# Altium project GeecPC.PrjPcb
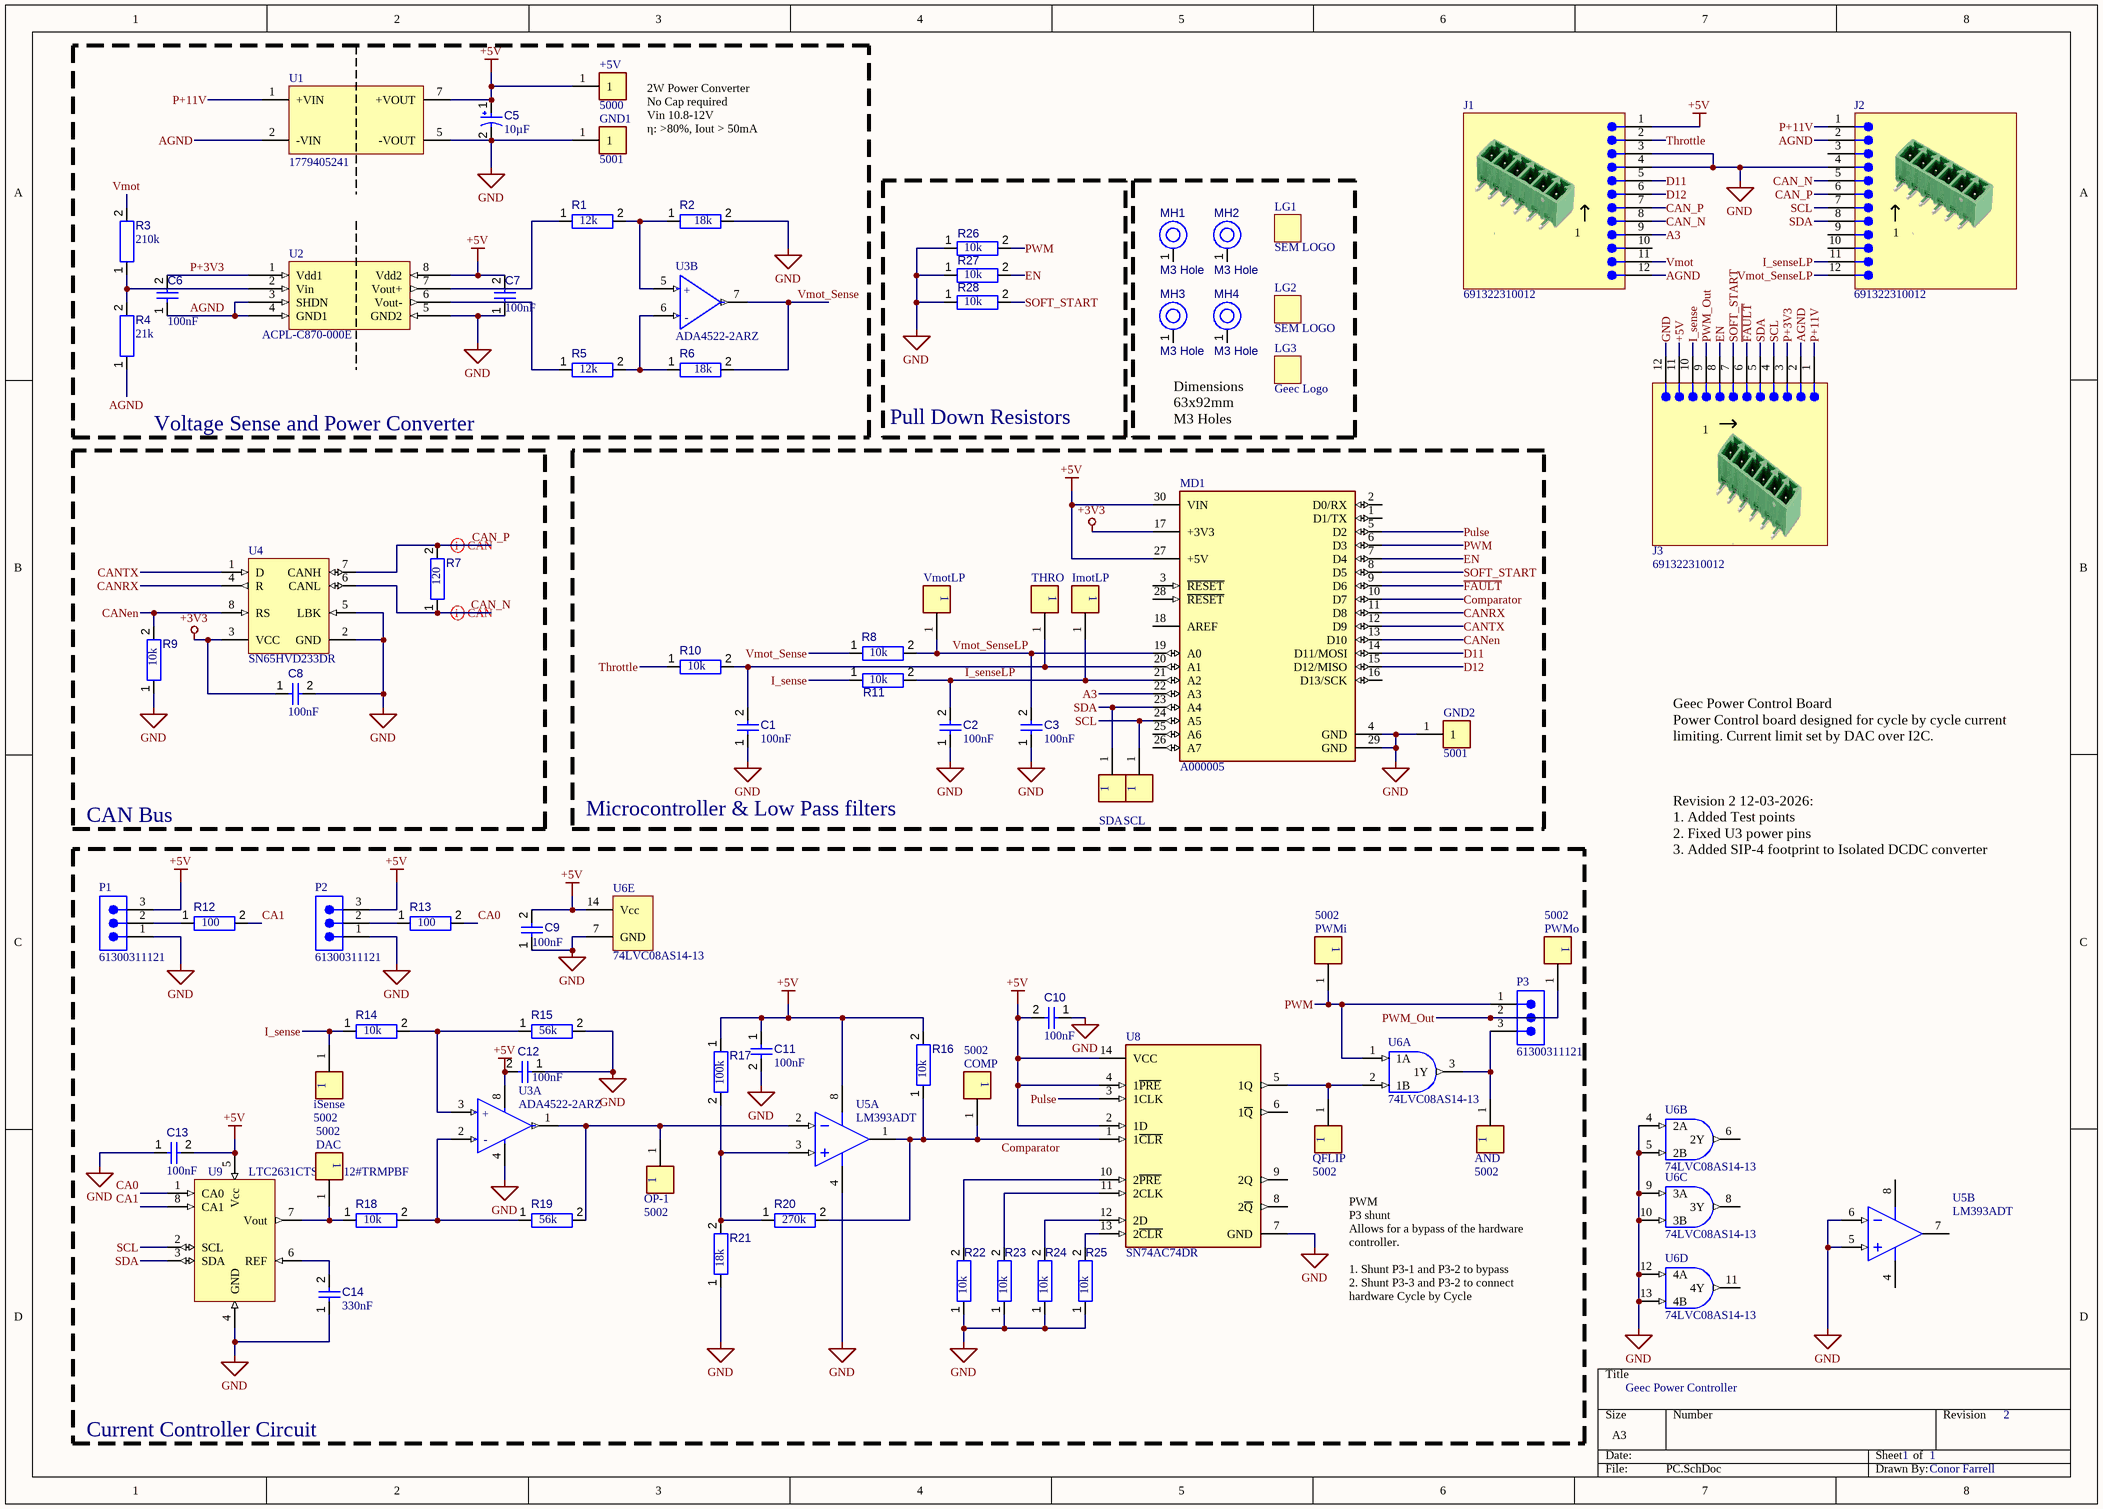
[diagram p0: PC.SchDoc]
1 sheet, 79 parts. Net scope: global (net labels, ports and power ports of the same name join across sheets).
Board file: PowerController.PcbDoc

## Sheet PC.SchDoc: Geec Power Controller
size A3; Author: Conor Farrell; Revision: 2; SheetNumber: 1; SheetTotal: 1

### Parts
+5V  5000  [FP-5000-MFG]
AND  5002  [FP-5002-MFG]
C1  value 100nF  [Cap-THT-Ceramic(7.2X2.5)]  (hidden comment: 100n-THT)
C2  value 100nF  [Cap-THT-Ceramic(7.2X2.5)]  (hidden comment: 100n-THT)
C3  value 100nF  [Cap-THT-Ceramic(7.2X2.5)]  (hidden comment: 100n-THT)
C5  value 10µF  [CAPPR55-200-1100X500X1200]  (hidden comment: ECA1HM100)
C6  value 100nF  [Cap-THT-Ceramic(7.2X2.5)]  (hidden comment: 100n-THT)
C7  value 100nF  [Cap-THT-Ceramic(7.2X2.5)]  (hidden comment: 100n-THT)
C8  value 100nF  [Cap-THT-Ceramic(7.2X2.5)]  (hidden comment: 100n-THT)
C9  value 100nF  [Cap-THT-Ceramic(7.2X2.5)]  (hidden comment: 100n-THT)
C10  value 100nF  [Cap-THT-Ceramic(7.2X2.5)]  (hidden comment: 100n-THT)
C11  value 100nF  [Cap-THT-Ceramic(7.2X2.5)]  (hidden comment: 100n-THT)
C12  value 100nF  [Cap-THT-Ceramic(7.2X2.5)]  (hidden comment: 100n-THT)
C13  value 100nF  [Cap-THT-Ceramic(7.2X2.5)]  (hidden comment: 100n-THT)
C14  value 330nF  [Cap-THT-Ceramic(7.2X2.5)]  (hidden comment: 330nF-THT-Film)
COMP  5002  [FP-5002-MFG]
DAC  5002  [FP-5002-MFG]
GND1  5001  [FP-5001-MFG]
GND2  5001  [FP-5001-MFG]
ImotLP  5002  [FP-5002-MFG]  (value not drawn)
iSense  5002  [FP-5002-MFG]
J1  691322310012  [691322310012]
J2  691322310012  [691322310012]
J3  691322310012  [691322310012]
LG1  SEM LOGO  [SEM LOGO-Footprint-1]
LG2  SEM LOGO  [SEM LOGO-Footprint-1]
LG3  Geec Logo  [Geec Logo-Footprint-1]
MD1  A000005  [FP-A000005-MFG]
MH1  M3 Hole  [M3 Hole-Footprint-1]
MH2  M3 Hole  [M3 Hole-Footprint-1]
MH3  M3 Hole  [M3 Hole-Footprint-1]
MH4  M3 Hole  [M3 Hole-Footprint-1]
OP-1  5002  [FP-5002-MFG]
P1  61300311121  [61300311121]
P2  61300311121  [61300311121]
P3  61300311121  [61300311121]
PWMi  5002  [FP-5002-MFG]
PWMo  5002  [FP-5002-MFG]
QFLIP  5002  [FP-5002-MFG]
R1  value 12k  [RESA60-630X240]  (hidden comment: 10k-ThroughHole-250mW)
R2  value 18k  [RESA60-630X240]  (hidden comment: 10k-ThroughHole-250mW)
R3  value 210k  [RESA60-630X240]  (hidden comment: 210k-Throughhole-250mW)
R4  value 21k  [RESA60-630X240]  (hidden comment: 21k-Throughhole-250mW)
R5  value 12k  [RESA60-630X240]  (hidden comment: 10k-ThroughHole-250mW)
R6  value 18k  [RESA60-630X240]  (hidden comment: 10k-ThroughHole-250mW)
R7  value 120  [RESA60-630X240]  (hidden comment: 120Ohm-Throughhole-250mW)
R8  value 10k  [RESA60-630X240]  (hidden comment: 10k-ThroughHole-250mW)
R9  value 10k  [RESA60-630X240]  (hidden comment: 10k-ThroughHole-250mW)
R10  value 10k  [RESA60-630X240]  (hidden comment: 10k-ThroughHole-250mW)
R11  value 10k  [RESA60-630X240]  (hidden comment: 10k-ThroughHole-250mW)
R12  value 100  [RESA60-630X240]  (hidden comment: 100Ohm-ThroughHole-250mW)
R13  value 100  [RESA60-630X240]  (hidden comment: 100Ohm-ThroughHole-250mW)
R14  value 10k  [RESA60-630X240]  (hidden comment: 10k-ThroughHole-250mW)
R15  value 56k  [RESA60-630X240]  (hidden comment: 100k-ThroughHole-250mW)
R16  value 10k  [RESA60-630X240]  (hidden comment: 10k-ThroughHole-250mW)
R17  value 100k  [RESA60-630X240]  (hidden comment: 100k-ThroughHole-250mW)
R18  value 10k  [RESA60-630X240]  (hidden comment: 10k-ThroughHole-250mW)
R19  value 56k  [RESA60-630X240]  (hidden comment: 100k-ThroughHole-250mW)
R20  value 270k  [RESA60-630X240]  (hidden comment: 270k-ThroughHole-250mW)
R21  value 18k  [RESA60-630X240]  (hidden comment: 18kOhm-ThroughHole-250mW)
R22  value 10k  [RESA60-630X240]  (hidden comment: 10k-ThroughHole-250mW)
R23  value 10k  [RESA60-630X240]  (hidden comment: 10k-ThroughHole-250mW)
R24  value 10k  [RESA60-630X240]  (hidden comment: 10k-ThroughHole-250mW)
R25  value 10k  [RESA60-630X240]  (hidden comment: 10k-ThroughHole-250mW)
R26  value 10k  [RESA60-630X240]  (hidden comment: 10k-ThroughHole-250mW)
R27  value 10k  [RESA60-630X240]  (hidden comment: 10k-ThroughHole-250mW)
R28  value 10k  [RESA60-630X240]  (hidden comment: 10k-ThroughHole-250mW)
SCL  5002  [FP-5002-MFG]  (value not drawn)
SDA  5002  [FP-5002-MFG]  (value not drawn)
THRO  5002  [FP-5002-MFG]  (value not drawn)
U1  1779405241  [SIP-7_1779405241]
U2  ACPL-C870-000E  [SOIC127P1150X173-8M]
U3  ADA4522-2ARZ  [FP-R-8-IPC_C]  (parts A,B of 2)
U4  SN65HVD233DR  [D0008A_L]
U5  LM393ADT  [ONSC-SOIC-8-751-07_AJ_V]  (parts A,B of 2)
U6  74LVC08AS14-13  [SOIC127P600X173-14N]  (parts A,B,C,D,E of 5)
U8  SN74AC74DR  [FP-D0014A-MFG]
U9  LTC2631CTS8-HZ12#TRMPBF  [TSOP65P280X100-8N]
VmotLP  5002  [FP-5002-MFG]  (value not drawn)

### Blocks framed on the sheet
Voltage Sense and Power Converter: +5V C5-C7 GND1 R1-R6 U1-U3
Pull Down Resistors: R26-R28
Microcontroller & Low Pass filters: C1-C3 GND2 ImotLP MD1 R8 R10 R11 SCL SDA THRO VmotLP
Current Controller Circuit: AND C9-C14 COMP DAC iSense OP-1 P1-P3 PWMi PWMo QFLIP R12-R25 U3 U5 U6 U8 U9

### Nets
+3V3: C8.1 MD1.17(+3V3) U4.3(VCC)
+5V: +5V.1 C5.1 C7.2 C9.2 C10.2 C11.1 C12.2 C13.2 J1.1 J3.11 MD1.27(+5V) MD1.30(VIN) P1.3 P2.3 R16.2 R17.1 U1.7(+VOUT) U2.8(Vdd2) U3.8(V+) U5.8(VCC) U6.14(Vcc) U8.2(1D) U8.4(1~{PRE}) U8.14(VCC) U9.5(Vcc)
GND: C1.1 C2.1 C3.1 C5.2 C7.1 C8.2 C9.1 C10.1 C11.2 C12.1 C13.1 C14.1 GND1.1 GND2.1 J1.3 J1.4 J2.4 J3.12 MD1.4(GND) MD1.29(GND) P1.1 P2.1 R2.2 R9.1 R15.2 R21.1 R22.1 R23.1 R24.1 R25.1 R26.1 R27.1 R28.1 U1.5(-VOUT) U2.5(GND2) U3.4(V-) U4.2(GND) U4.5(LBK) U5.4(GND) U5.5(IN2+) U5.6(IN2-) U6.4(2A) U6.5(2B) U6.7(GND) U6.9(3A) U6.10(3B) U6.12(4A) U6.13(4B) U8.7(GND) U9.4(GND)
~{FAULT}: J3.6 MD1.9(D6)
A3: J1.9 MD1.22(A3)
AGND: C6.1 J1.12 J2.2 J3.2 R4.1 U1.2(-VIN) U2.3(SHDN) U2.4(GND1)
CA0: R13.2 U9.1(CA0)
CA1: R12.2 U9.8(CA1)
CAN_N: J1.8 J2.5 R7.1 U4.6(CANL)
CAN_P: J1.7 J2.6 R7.2 U4.7(CANH)
CANen: MD1.13(D10) R9.2 U4.8(RS)
CANRX: MD1.11(D8) U4.4(R)
CANTX: MD1.12(D9) U4.1(D)
Comparator: COMP.1 MD1.10(D7) R16.1 R20.2 U5.1(OUT1) U8.1(1~{CLR})
D11: J1.5 MD1.14(D11/MOSI)
D12: J1.6 MD1.15(D12/MISO)
EN: J3.8 MD1.7(D4) R27.2
I_sense: iSense.1 J3.10 R11.1 R14.1
I_senseLP: C2.2 ImotLP.1 J2.11 MD1.21(A2) R11.2
P+3V3: C6.2 J3.3 U2.1(Vdd1)
P+11V: J2.1 J3.1 U1.1(+VIN)
Pulse: MD1.5(D2) U8.3(1CLK)
PWM: MD1.6(D3) P3.1 PWMi.1 R26.2 U6.1(1A)
PWM_Out: J3.9 P3.2 PWMo.1
SCL: J2.7 J3.4 MD1.24(A5) SCL.1 U9.2(SCL)
SDA: J2.8 J3.5 MD1.23(A4) SDA.1 U9.3(SDA)
SOFT_START: J3.7 MD1.8(D5) R28.2
Throttle: J1.2 R10.1
Vmot: J1.11 R3.2
Vmot_Sense: R6.2 R8.1 U3.7(OUT_B)
Vmot_SenseLP: C3.2 J2.12 MD1.19(A0) R8.2 VmotLP.1
NetAND_1: AND.1 P3.3 U6.3(1Y)
NetC1_2: C1.2 MD1.20(A1) R10.2 THRO.1
NetC14_2: C14.2 U9.6(REF)
NetDAC_1: DAC.1 R18.1 U9.7(Vout)
NetOP-1_1: OP-1.1 R19.2 U3.1(OUT_A) U5.2(IN1-)
NetP1_2: P1.2 R12.1
NetP2_2: P2.2 R13.1
NetQFLIP_1: QFLIP.1 U6.2(1B) U8.5(1Q)
NetR1_1: R1.1 U2.7(Vout+)
NetR1_2: R1.2 R2.1 U3.5(+IN_B)
NetR3_1: R3.1 R4.2 U2.2(Vin)
NetR5_1: R5.1 U2.6(Vout-)
NetR5_2: R5.2 R6.1 U3.6(-IN_B)
NetR14_2: R14.2 R15.1 U3.3(+IN_A)
NetR17_2: R17.2 R20.1 R21.2 U5.3(IN1+)
NetR18_2: R18.2 R19.1 U3.2(-IN_A)
NetR22_2: R22.2 U8.10(2~{PRE})
NetR23_2: R23.2 U8.11(2CLK)
NetR24_2: R24.2 U8.12(2D)
NetR25_2: R25.2 U8.13(2~{CLR})

Not connected (* = marked no-connect by the designer): J1 10; J2 3 9 10; MD1 1(D1/TX) 2(D0/RX) 3(~{RESET}) 16(D13/SCK) 18(AREF) 25(A6) 26(A7) 28(~{RESET}); MH1 1(H1); MH2 1(H1); MH3 1(H1); MH4 1(H1); U5 7(OUT2); U6 6(2Y) 8(3Y) 11(4Y); U8 6(1~{Q}) 8(2~{Q}) 9(2Q)

### Layout directives
differential pair: CAN_N, CAN_P

### Notes on the sheet
- 2W Power Converter
  No Cap required
  Vin 10.8-12V
  η: >80%, Iout > 50mA
- Dimensions
  63x92mm
  M3 Holes
- CAN Bus
- Geec Power Control Board
  Power Control board designed for cycle by cycle current limiting. Current limit set by DAC over I2C.
  Revision 2 12-03-2026:
  1. Added Test points
  2. Fixed U3 power pins
  3. Added SIP-4 footprint to Isolated DCDC converter
- PWM
  P3 shunt
  Allows for a bypass of the hardware controller.
  1. Shunt P3-1 and P3-2 to bypass
  2. Shunt P3-3 and P3-2 to connect hardware Cycle by Cycle
- (in symbol CMP-014-00005-2, part A) +; -
- (in symbol CMP-014-00005-2, part B) +; -

### Library data of the parts
+5V = CMP-00030-00004-2: Cable Wrap, 1/2 Inch, Polyethylene, Natural, 50 Ft, Spirap Series; Hole Diameter: 1.6mm; Mounting Technology: PCB, Through Hole; Color: Red
AND COMP DAC ImotLP iSense OP-1 PWMi PWMo QFLIP SCL SDA THRO VmotLP = CMP-00030-00002-2: Test Point, Mini, Thm, Pc, .300 L, .100 Od, Heat Resistant Nylon 46, White; Hole Diameter: 1.6mm; Color: White; Mounting Technology: PCB, Through Hole
C1-C3 C6-C13 = CMP-001-00091-1: 100nF, Throughhole Film Capacitor, 5mm spacing; Tolerance: 10%; Pins: 2; Capacitor Type: Film; Case/Package: THT
C5 = CMP-001-00025-7: Aluminum Electrolytic Capacitor, 10 uF, +/- 20%, 50 V, -40 to 85 degC, 2-Pin THD, RoHS, Bulk; Manufacturer: Panasonic; Ripple Current (AC): 65mA; Voltage Rating: 50V; Mounting Technology: TH; RoHS Compliant: True; Capacitor Type: Electrolytic; Datasheet Version: Rev. 05, 10/2016; Min Operating Temperature: -40°C; Packaging: Bulk; Ripple Current: 65mA; Tolerance: 20%; Max Operating Temperature: 85°C; Datasheet URL: https://industrial.panasonic.com/cdbs/www-data/pdf/RDF0000/ABA0000C1218.pdf; Lead Pitch: 2mm; Pins: 2; Diameter: 5mm; Manufacturer URL: http://www.panasonic.com/; Package Reference: CAPPR55-200-1100X500X1200; Package Description: 2-Pin Radial Lead, Dia 5 mm, Height 12 mm; Case/Package: Radial; Package Quantity: 200
C14 = CMP-001-00092-2: 330nF, Throughhole Film Capacitor, 5mm spacing; Tolerance: 10%; Capacitor Type: THT
GND1 GND2 = CMP-00030-00001-2: Test Point, Mini, Thm, Pc, .300 L, .100 Od, Heat Resistant Nylon 46, Black; Hole Diameter: 1.6mm; Color: Black; Pins: 1; Mounting Technology: PCB, Through Hole
J1-J3 = CMP-002-00073-2: Terminal Block, R/A Header, 12Pos, Th Rohs Compliant: Yes; System: Connector; Gender: Male
LG1 LG2 = CMP-00028-00008-2: SEM Logo Required for Power Electronics
LG3 = CMP-00028-00009-2
MD1 = CMP-020-00023-1: ATmega328 Microcontroller Development Board 16MHz CPU 2KB RAM 1KB/32KB EEPROM/Flash; Min Supply Voltage: 7V; Interface: I2C, SPI, USB; Max Supply Voltage: 12V; Frequency: 16MHz
MH1-MH4 = CMP-00028-00007-2: Hole for M3 bolt
P1-P3 = CMP-002-00212-1: WR-PHD Pin Header, THT, Vertical, pitch 2.54mm, 1 Row, 3P; Manufacturer: Wurth Elektronik; Contact Resistance: 20mOhm; Withstanding Voltage: 500V; Rated Current: 3A; Working Voltage: 250V; Pin Count: 3; Gender: Pin Header; Pins: 3; Number of Rows: 1; Packaging: Bag; Pitch: 2.54mm; Match Code: WR-PHD; ComponentLink1URL: https://www.we-online.com/redexpert/article/61300311121?ad; ComponentLink2URL: https://www.we-online.com/redexpert/spec/61300311121?ad; Orientation: Vertical; Operating Temperature Min: -40°C; Mount: Through Hole; Operating Temperature Max: 105°C; Source: WR-PHD.SchLib; Manufacturer Part Number: 61300311121; Design Item ID: 61300311121; Category: Board-to-Board Connectors; ComponentLink1Description: Website Link; Component Type: Standard; ComponentLink2Description: Datasheet Link
R1 R2 R5 R6 R8-R11 R14 R16 R18 R22-R28 = CMP-009-00196-1: 10kOhm Resistor, Through Hole, 1/4W; Power: 250mW; Tolerance: 5%; Voltage Rating: 50V; Case/Package: THT; Pins: 2
R3 = CMP-009-00200-2: 210kOhm Resistor, Throughhole, 1/4W; Tolerance: 5%; Power: 250mW; Voltage Rating: 229V; Case/Package: Throughhole
R4 = CMP-009-00201-1: 21kOhm Resistor, Throughhole, 1/4W; Tolerance: 5%; Power: 250mW; Voltage Rating: 72V; Mounting Technology: Throughhole; Case/Package: Throughhole
R7 = CMP-009-00199-2: 120Ohm Resistor, Through Hole, 1/4W; Tolerance: 5%; Power: 250mW; Voltage Rating: 5.5V; Case/Package: Throughole; Mounting Technology: Throughhole
R12 R13 = CMP-009-00195-1: 100Ohm Resistor Through Hole 1/4W; Voltage Rating: 5V; Tolerance: 5%; Power: 250mW; Case/Package: THT
R15 R17 R19 = CMP-009-00192-1: 100kOhm Resistor, Through hole, 250mW; Voltage Rating: 158V; Tolerance: 5%; Case/Package: ThroughHole; Power: 250mW
R20 = CMP-009-00198-1: 270kOhm Resistor, Through Hole, 1/4W; Tolerance: 5%; Voltage Rating: 244V; Power: 250mW; Pins: 2; Case/Package: THT; Mounting Technology: THT
R21 = CMP-009-00197-1: 18kOhm Resistor, Through Hole, 1/4W; Power: 250mW; Tolerance: 5%; Voltage Rating: 67V; Pins: 2; Mounting Technology: THT; Case/Package: THT
U1 = CMP-013-000028-2: WPME-FISM Fixed Isolated Module, SIP-7, 10.8 - 13.2 Vin, 5 Vout; Manufacturer: Wurth Elektronik; Short Circuit Protection: continuous; Isolation Voltage: 3000 V; Type of Insulation: Functional; Output Power: 2 W; Output Voltage: 5 V; ComponentLink2URL: https://www.we-online.com/redexpert/spec/1779405241?ad; Component Type: Standard; Input Voltage: 10.8 - 13.2 V; Design Item ID: 1779405241; Pin Count: 4; Min Operating Temperature: -40 °C; ComponentLink2Description: Datasheet Link; Max Operating Temperature: 105 °C; Case/Size Code: SIP-7; Width: 7.05 mm; Category: Isolated Converter; ComponentLink1URL: https://www.we-online.com/redexpert/article/1779405241?ad; Source: WPME-FISM.SchLib; Packaging: Tube; Length: 19.65 mm; Match Code: WPME-FISM; Manufacturer Part Number: 1779405241; ComponentLink1Description: Website Link; Height: 10.16 mm; Mount: Through Hole
U2 = CMP-00004-3: IC OPAMP ISOLATION 1 CIRC 8SO Isolation Amplifier 1 Circuit Differential 8-SO Stretched; Bandwidth: 100kHz; Number of Amplifiers: 1; Output Current per Channel: 30mA; Input Bias Current: 1.5nA; Isolation Voltage: 5kV; Max Supply Voltage: 5.5V; Operating Supply Current: 10.5mA; Operating Supply Voltage: 5V; Min Supply Voltage: 3V; Input Offset Voltage (Vos): 300µV; Propagation Delay: 6.5µs; Forward Current: 230mA; Output Type: ANALOG, Digital; Min Operating Temperature: -40°C; China RoHS: Compliant; Case/Package: SO; Terminal Pitch: 1.27mm; RoHS: Compliant; REACH SVHC: Yes; Radiation Hardening: No; Mounting Technology: Surface Mount; -3db Bandwidth: 100kHz; Max Operating Temperature: 105°C; Contact Plating: Tin; Number of Circuits: 1; Height - Seated (Max): 3.607mm; Turn-On Delay Time: 6.5µs; Input Current: 10.5mA; Length: 6.807mm; Width: 5.85mm; Height: 3.18mm; Pins: 8; Number of Terminals: 8; Number of Channels: 1; Lifecycle Status: Production
U3 = CMP-014-00005-2: IC OPAMP ZERO-DRIFT 2 CIRC 8SOIC Zero-Drift Amplifier 2 Circuit Rail-to-Rail 8-SOIC; Min Supply Voltage: 4.5V; Max Supply Voltage: 55V; Case/Package: SOIC; Mounting Technology: Surface Mount; Min Operating Temperature: -40°C; Max Operating Temperature: 125°C; Pins: 8
U4 = CMP-015-00010-1: 3.3 V CAN Transceiver with Standby Mode, Loopback 8-SOIC -40 to 125; Min Supply Voltage: 3V; Max Supply Voltage: 3.6V; Min Operating Temperature: -40°C; Case/Package: SOIC; Pins: 8; Max Operating Temperature: 125°C
U5 = CMP-014-00006-1: LM393 Series Dual 36 V 100 nA SMT Low Power Voltage Comparator - SOIC-8; Min Supply Voltage: 2V; Number of Channels: 2; Max Supply Voltage: 36V; Max Supply Current: 2.5mA; Output Type: TTL; Min Operating Temperature: 0°C; Case/Package: SO; Pins: 8; Max Operating Temperature: 70°C; Mounting Technology: Surface Mount
U6 = CMP-016-00011-1: 74LVC Series 5.5 V Surface Mount Quadruple 2-Input AND Gate - SOIC-14; Min Supply Voltage: 1.65V; Max Supply Voltage: 5.5V; Case/Package: SO; Min Operating Temperature: -40°C; Pins: 14; Mounting Technology: Surface Mount; Max Operating Temperature: 125°C
U8 = CMP-016-00012-1: Dual Positive-Edge-Triggered D-Type Flip-Flops With Clear and Preset 14-SOIC -40 to 85; Min Supply Voltage: 2V; Nominal Supply Current: 2µA; Frequency: 160MHz; Max Supply Voltage: 6V; Min Operating Temperature: -40°C; Pins: 14; Case/Package: SOIC; Mounting Technology: Surface Mount; Max Operating Temperature: 85°C
U9 = CMP-00024-00009-3: IC DAC 12BIT V-OUT TSOT23-8 12 Bit Digital to Analog Converter 1 TSOT-23-8; Min Supply Voltage: 4.5V; Max Supply Voltage: 5.5V; Number of Channels: 1; Number of Bits: 12; Interface: 2-Wire, I2C; Max Operating Temperature: 70°C; Pins: 8; Min Operating Temperature: 0°C; Mounting Technology: Surface Mount; Case/Package: TSOT